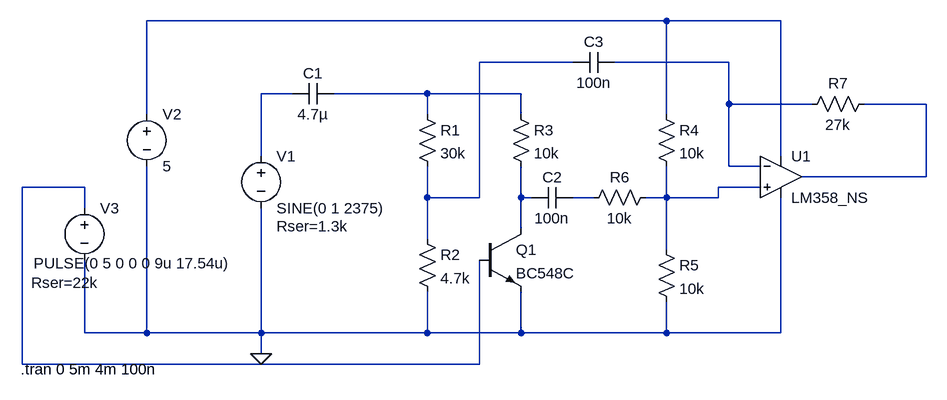
[diagram p0: schematic iw1cgw.asc]
iw1cgw.asc, the LTspice schematic file:
Version 4
SHEET 1 1092 680
WIRE 688 -96 -112 -96
WIRE 864 -96 688 -96
WIRE 544 -32 400 -32
WIRE 784 -32 608 -32
WIRE 112 16 64 16
WIRE 320 16 176 16
WIRE 464 16 320 16
WIRE 784 32 784 -32
WIRE 912 32 784 32
WIRE 1088 32 992 32
WIRE -112 48 -112 -96
WIRE 320 48 320 16
WIRE 464 48 464 16
WIRE 688 48 688 -96
WIRE 64 112 64 16
WIRE 864 112 864 -96
WIRE 784 128 784 32
WIRE 832 128 784 128
WIRE 1088 144 1088 32
WIRE 1088 144 896 144
WIRE -208 160 -304 160
WIRE 832 160 768 160
WIRE 320 176 320 128
WIRE 400 176 400 -32
WIRE 400 176 320 176
WIRE 464 176 464 128
WIRE 480 176 464 176
WIRE 576 176 544 176
WIRE 688 176 688 128
WIRE 688 176 656 176
WIRE 768 176 768 160
WIRE 768 176 688 176
WIRE -208 192 -208 160
WIRE 464 224 464 176
WIRE 320 240 320 176
WIRE 688 256 688 176
WIRE -208 384 -208 272
WIRE -112 384 -112 128
WIRE -112 384 -208 384
WIRE 64 384 64 192
WIRE 64 384 -112 384
WIRE 320 384 320 320
WIRE 320 384 64 384
WIRE 464 384 464 320
WIRE 464 384 320 384
WIRE 688 384 688 336
WIRE 688 384 464 384
WIRE 864 384 864 176
WIRE 864 384 688 384
WIRE 64 416 64 384
WIRE -304 432 -304 160
WIRE 400 432 400 272
WIRE 400 432 -304 432
FLAG 64 416 0
SYMBOL voltage 64 96 R0
WINDOW 123 0 0 Left 2
WINDOW 39 24 124 Left 2
SYMATTR InstName V1
SYMATTR Value SINE(0 1 2375)
SYMATTR SpiceLine Rser=1.3k
SYMBOL cap 176 0 R90
WINDOW 0 0 32 VBottom 2
WINDOW 3 32 32 VTop 2
SYMATTR InstName C1
SYMATTR Value 4.7µ
SYMBOL voltage -112 32 R0
WINDOW 123 0 0 Left 2
WINDOW 39 0 0 Left 2
SYMATTR InstName V2
SYMATTR Value 5
SYMBOL voltage -208 176 R0
WINDOW 3 -78 101 Left 2
WINDOW 123 0 0 Left 2
WINDOW 39 -82 131 Left 2
SYMATTR InstName V3
SYMATTR Value PULSE(0 5 0 0 0 9u 17.54u)
SYMATTR SpiceLine Rser=22k
SYMBOL res 304 32 R0
SYMATTR InstName R1
SYMATTR Value 30k
SYMBOL res 304 224 R0
SYMATTR InstName R2
SYMATTR Value 4.7k
SYMBOL res 448 32 R0
SYMATTR InstName R3
SYMATTR Value 10k
SYMBOL npn 400 224 R0
SYMATTR InstName Q1
SYMATTR Value BC548C
SYMBOL res 672 32 R0
SYMATTR InstName R4
SYMATTR Value 10k
SYMBOL res 672 240 R0
SYMATTR InstName R5
SYMATTR Value 10k
SYMBOL cap 544 160 R90
WINDOW 0 0 32 VBottom 2
WINDOW 3 32 32 VTop 2
SYMATTR InstName C2
SYMATTR Value 100n
SYMBOL res 672 160 R90
WINDOW 0 0 56 VBottom 2
WINDOW 3 32 56 VTop 2
SYMATTR InstName R6
SYMATTR Value 10k
SYMBOL ZZZ\\OpAmp\\LM358_NS 864 144 R0
SYMATTR InstName U1
SYMBOL cap 608 -48 R90
WINDOW 0 0 32 VBottom 2
WINDOW 3 32 32 VTop 2
SYMATTR InstName C3
SYMATTR Value 100n
SYMBOL res 1008 16 R90
WINDOW 0 0 56 VBottom 2
WINDOW 3 32 56 VTop 2
SYMATTR InstName R7
SYMATTR Value 27k
TEXT -306 440 Left 2 !.tran 0 5m 4m 100n

The netlist it stands for:
* iw1cgw.asc
V1 N004 0 SINE(0 1 2375) Rser=1.3k
C1 N005 N004 4.7µ
V2 N001 0 5
V3 N007 0 PULSE(0 5 0 0 0 9u 17.54u) Rser=22k
R1 N005 N002 30k
R2 N002 0 4.7k
R3 N005 N009 10k
Q1 N009 N007 0 0 BC548C
R4 N001 N008 10k
R5 N008 0 10k
C2 N010 N009 100n
R6 N008 N010 10k
* U1: LM358_NS (symbol ZZZ\OpAmp\LM358_NS not available, pins judged from their places): In+=N008 In-=N003 V+=N001 V-=0 OUT=N006
C3 N003 N002 100n
R7 N006 N003 27k
.model NPN NPN
.model PNP PNP
.lib standard.bjt
.tran 0 5m 4m 100n
.backanno
.end